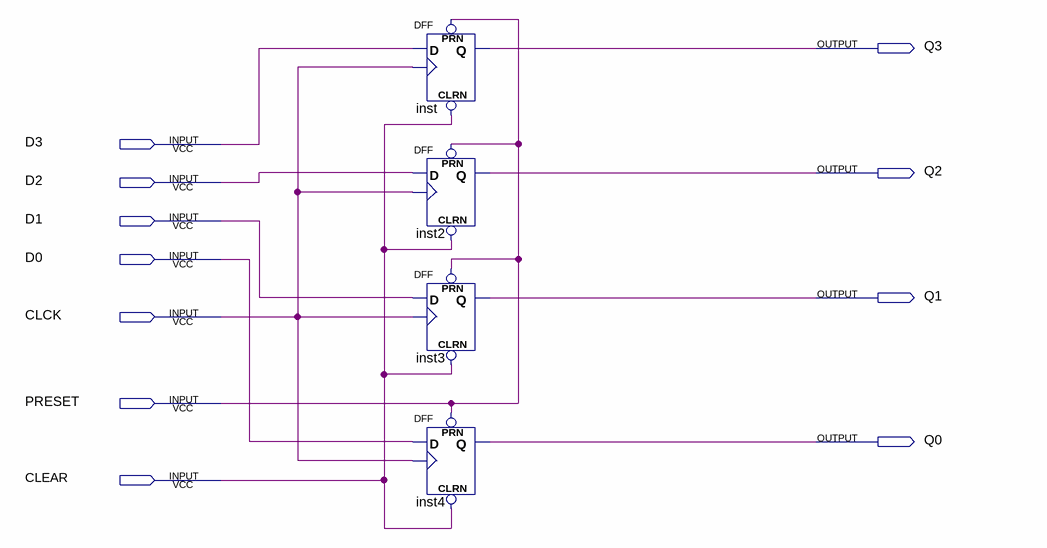
[diagram p0: schematic sheet]
// Quartus schematic REG_PARALELO.bdf as structural Verilog: 4 symbols, 11 pins
module REG_PARALELO (
  input  D3,
  input  D2,
  input  D1,
  input  D0,
  input  CLCK,
  input  PRESET,
  input  CLEAR,
  output Q3,
  output Q2,
  output Q1,
  output Q0
);

  DFF inst (.CLRN(CLEAR), .CLK(CLCK), .D(D3), .PRN(PRESET), .Q(Q3));
  DFF inst2 (.CLRN(CLEAR), .CLK(CLCK), .D(D2), .PRN(PRESET), .Q(Q2));
  DFF inst3 (.CLRN(CLEAR), .CLK(CLCK), .D(D1), .PRN(PRESET), .Q(Q1));
  DFF inst4 (.CLRN(CLEAR), .CLK(CLCK), .D(D0), .PRN(PRESET), .Q(Q0));
endmodule
